# EAGLE design v1 (EAGLE 7.1.0)
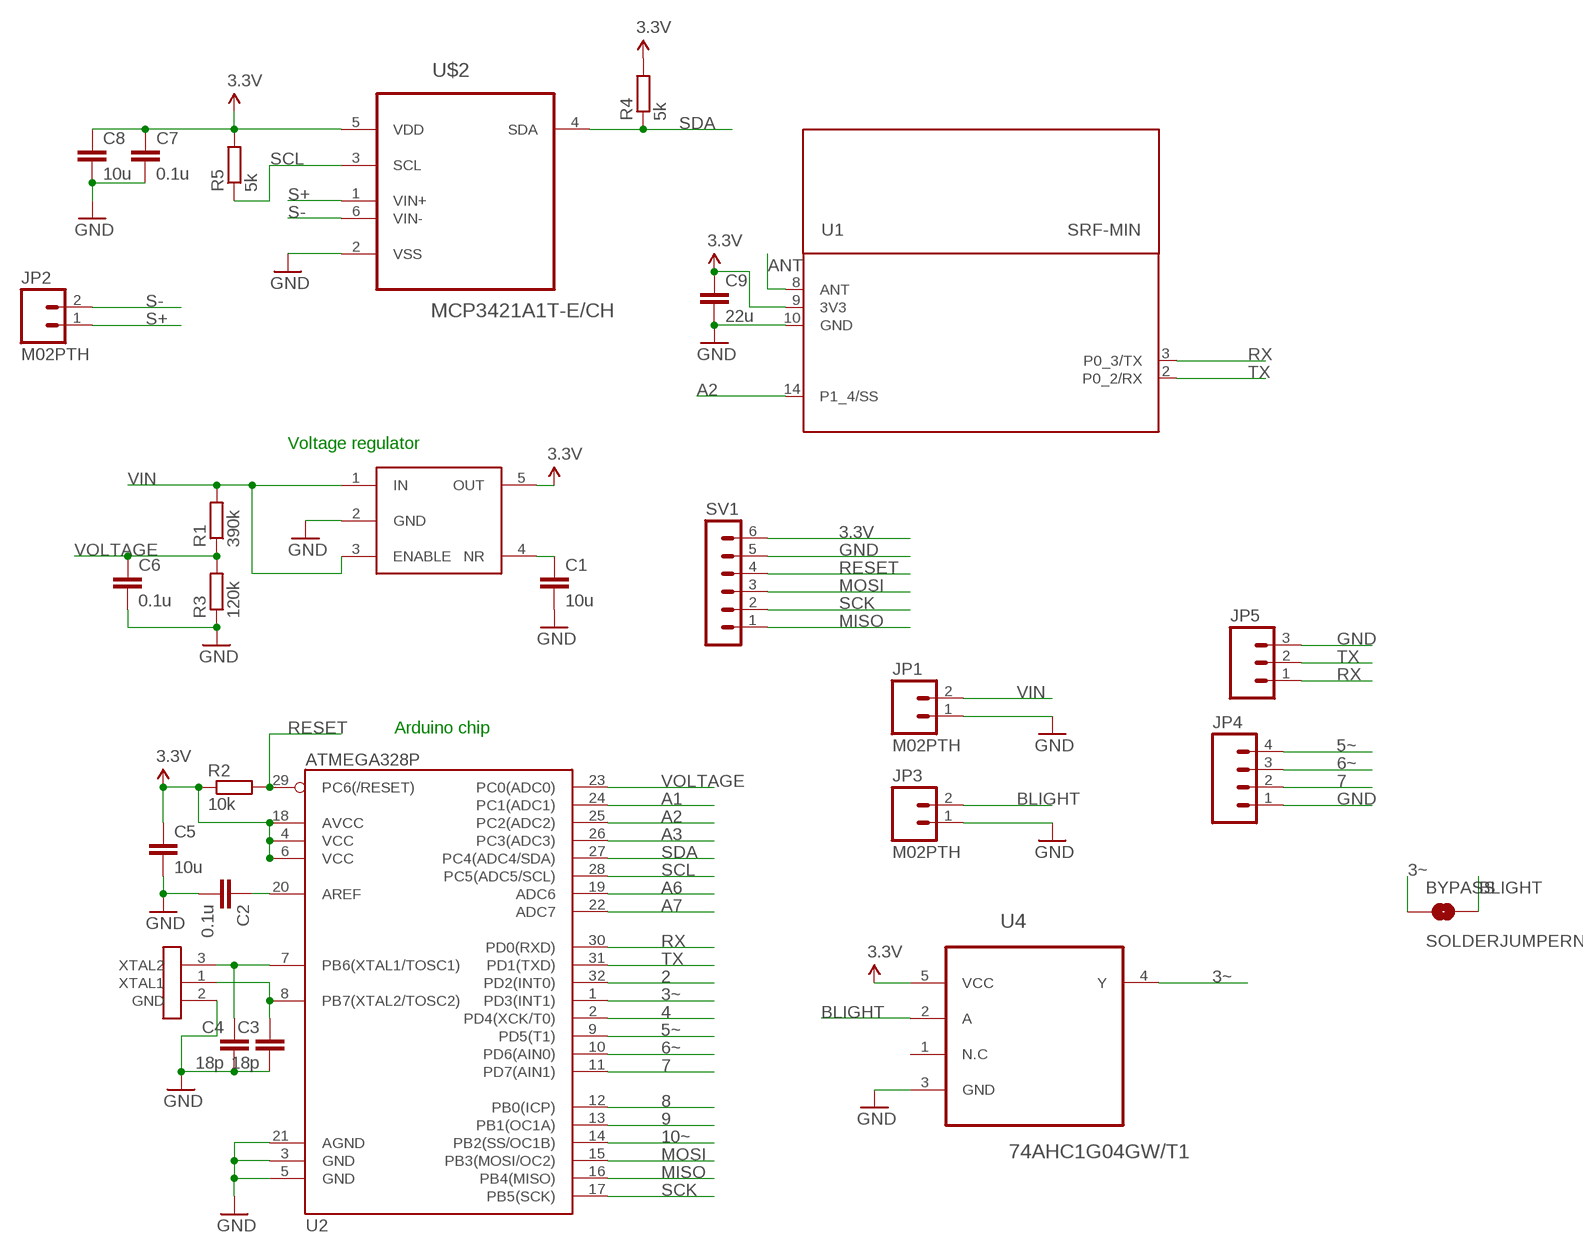
[diagram p0: schematic, sheet 1]

## Parts
BYPASS  SOLDERJUMPERNO  [SJ_2S-NO]
C1  10u  C-EUC0805  [C0805]
C2  0.1u  C-EUC0805  [C0805]
C3  18p  C-EUC0805  [C0805]
C4  18p  C-EUC0805  [C0805]
C5  10u  C-EUC0805  [C0805]
C6  0.1u  C-EUC0805  [C0805]
C7  0.1u  C-EUC0805  [C0805]
C8  10u  C-EUC0805  [C0805]
C9  22u  C-EUC0805  [C0805]
JP1  M02PTH  [1X02]
JP2  M02PTH  [1X02]
JP3  M02PTH  [1X02]
JP4  M04PTH  [1X04]
JP5  M03PTH  [1X03]
R1  390k  R-EU_R0805  [R0805]
R2  10k  R-EU_R0805  [R0805]
R3  120k  R-EU_R0805  [R0805]
R4  5k  R-EU_R0805  [R0805]
R5  5k  R-EU_R0805  [R0805]
SV1  MA06-1  [MA06-1]
TPS73133  TPS731XX  [SOT95P284X120-5N]
U1  SRF-MIN  [SRF-LANDING-1.2-MIN]
U2  ATMEGA328P  ATMEGA328_SMT  [TQFP32-08]
U4  74AHC1G04GW/T1  [SOT65P210X110-5N]
U$1  CRYSTAL-GND  [CRYSTAL-SMD-5X3-LARGE-GND]
U$2  MCP3421A1T-E/CH  [SOT95P270X145-6N]

## Nets
2: U2.32(PD2(INT0))
3.3V: C5.1 C7.1 C8.1 C9.1 R2.1 R4.2 R5.2 SV1.6 TPS73133.5(OUT) U1.9(3V3) U2.4(VCC) U2.6(VCC) U2.18(AVCC) U4.5(VCC) U$2.5(VDD)
3~: BYPASS.1 U2.1(PD3(INT1)) U4.4(Y)
4: U2.2(PD4(XCK/T0))
5~: JP4.4 U2.9(PD5(T1))
6~: JP4.3 U2.10(PD6(AIN0))
7: JP4.2 U2.11(PD7(AIN1))
8: U2.12(PB0(ICP))
9: U2.13(PB1(OC1A))
10~: U2.14(PB2(SS/OC1B))
A1: U2.24(PC1(ADC1))
A2: U1.14(P1_4/SS) U2.25(PC2(ADC2))
A3: U2.26(PC3(ADC3))
A6: U2.19(ADC6)
A7: U2.22(ADC7)
ANT: U1.8(ANT)
BLIGHT: BYPASS.2 JP3.2 U4.2(A)
GND: C1.2 C2.2 C3.2 C4.2 C5.2 C6.2 C7.2 C8.2 C9.2 JP1.1 JP3.1 JP4.1 JP5.3 R3.1 SV1.5 TPS73133.2(GND) U1.10(GND) U2.3(GND) U2.5(GND) U2.21(AGND) U4.3(GND) U$1.2(GND) U$2.2(VSS)
MISO: SV1.1 U2.16(PB4(MISO))
MOSI: SV1.3 U2.15(PB3(MOSI/OC2))
N$2: C2.1 U2.20(AREF)
N$3: C4.1 U2.7(PB6(XTAL1/TOSC1)) U$1.3(XTAL2)
N$4: C3.1 U2.8(PB7(XTAL2/TOSC2)) U$1.1(XTAL1)
N$7: C1.1 TPS73133.4(NR)
RESET: R2.2 SV1.4 U2.29(PC6(/RESET))
RX: JP5.1 U1.3(P0_3/TX) U2.30(PD0(RXD))
S+: JP2.1 U$2.1(VIN+)
S-: JP2.2 U$2.6(VIN-)
SCK: SV1.2 U2.17(PB5(SCK))
SCL: R5.1 U2.28(PC5(ADC5/SCL)) U$2.3(SCL)
SDA: R4.1 U2.27(PC4(ADC4/SDA)) U$2.4(SDA)
TX: JP5.2 U1.2(P0_2/RX) U2.31(PD1(TXD))
VIN: JP1.2 R1.2 TPS73133.1(IN) TPS73133.3(ENABLE)
VOLTAGE: C6.1 R1.1 R3.2 U2.23(PC0(ADC0))
Unconnected: U4.1(N.C)

## Notes on the sheet
- Voltage regulator
- Arduino chip

## Library data of the parts
BYPASS = SparkFun-Passives:SOLDERJUMPER: Solder Jumper Standard SMD solder jumper. Used to automate production. Two varients : Normally Open and Normally Closed are the same, but have different paste layers. NC will have a large amount of paste and should jumper during reflow.
C1-C9 = rcl:C-EU: CAPACITOR, European symbol
JP1-JP3 = SparkFun-Connectors:M02: Standard 2-pin 0.1" header. Use with - straight break away headers ( PRT-00116) - right angle break away headers (PRT-00553) - swiss pins (PRT-00743) - machine pins (PRT-00117) - female headers (PRT-00115) Molex polarized connector foot print use with: PRT-08233 with associated crimp pins and housings. 2.54_SCREWTERM for use with PRT-10571. 3.5mm Screw Terminal footprints for PRT-08084 5mm Screw Terminal footprints for use with PRT-08433
JP4 = SparkFun-Connectors:M04: Header 4 Standard 4-pin 0.1" header. Use with straight break away headers (SKU : PRT-00116), right angle break away headers (PRT-00553), swiss pins (PRT-00743), machine pins (PRT-00117), and female headers (PRT-00115). Molex polarized connector foot print use with SKU : PRT-08231 with associated crimp pins and housings. 1MM SMD Version SKU: PRT-10208
JP5 = SparkFun-Connectors:M03: Header 3 Standard 3-pin 0.1" header. Use with straight break away headers (SKU : PRT-00116), right angle break away headers (PRT-00553), swiss pins (PRT-00743), machine pins (PRT-00117), and female headers (PRT-00115). Molex polarized connector foot print use with SKU : PRT-08232 with associated crimp pins and housings.
R1-R5 = rcl:R-EU_: RESISTOR, European symbol
SV1 = con-lstb:MA06-1: PIN HEADER; OC_FARNELL: unknown; OC_NEWARK: unknown
TPS73133 = Ava:TPS731XX
U1 = Ciseco Footprints:SRF-MIN
U2 = SparkFun-DigitalIC:ATMEGA328_SMT: 32-Pin Atmega328 part Commonly used on Arduino compatible boards Available in QFP and QFN packages TQFP is IC-09069 QFN is non-stock; PROD_ID: IC-09069
U4 = 74AHC1G04GW:74AHC1G04GW/T1: Inverter; MPN: 74AHC1G04GW/T1; OC_FARNELL: 1085239; OC_NEWARK: 99K0513; PACKAGE: SOT353-1-5; SUPPLIER: NXP
U$1 = SparkFun-FreqCtrl:CRYSTAL-GND
U$2 = MCP3421:MCP3421A1T-E/CH: Analog-to-Digital Converter; MPN: MCP3421A1T-E/CH; OC_FARNELL: 1605568; OC_NEWARK: 11N7998; PACKAGE: SOT-6; SUPPLIER: Microchip

## Board
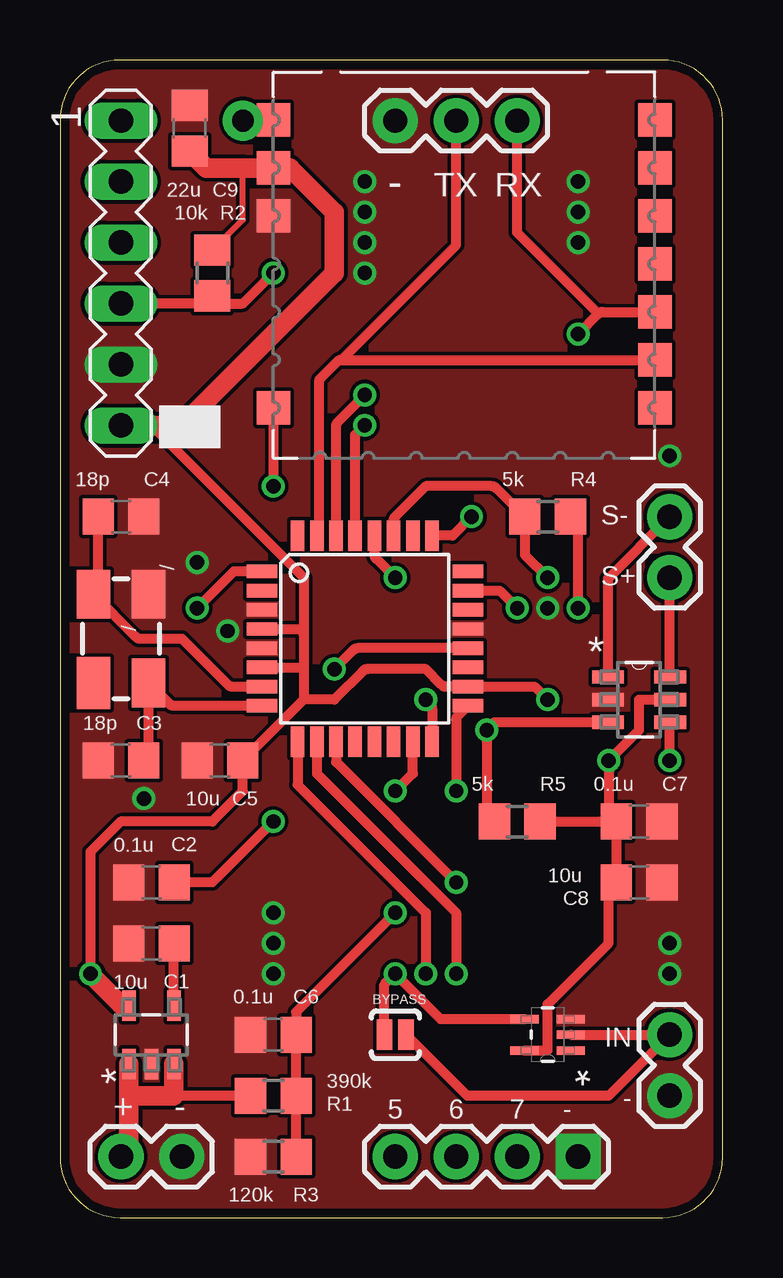
[diagram p1: board, top side]
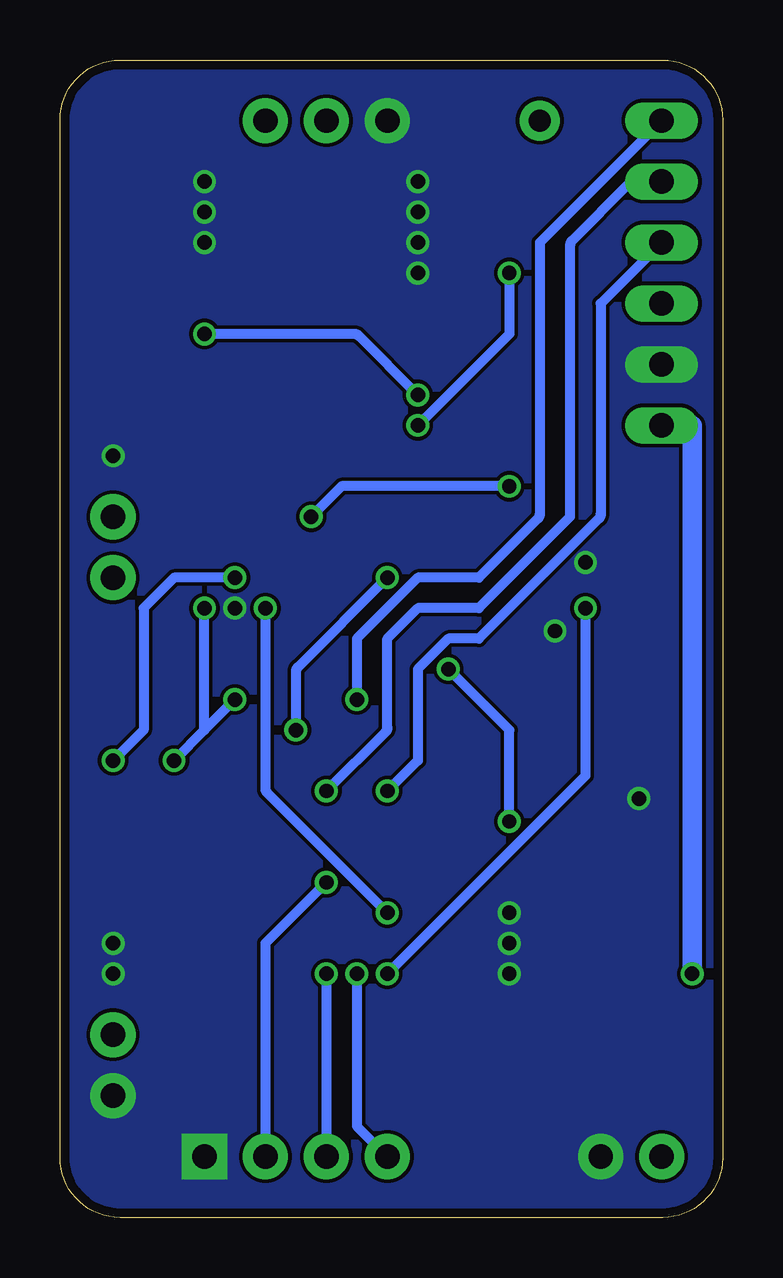
[diagram p2: board, bottom side, seen from below]

Size 27.61 x 48.25 mm. Coordinates in mm from the lower left corner, seen from the top.
Outline: 0,45.75 0,2.5 arc90 2.5,0 25.11,0 arc90 27.61,2.5 27.61,45.75 arc90 25.11,48.25 2.5,48.25 arc90 0,45.75
Copper layers (1*16): Top 0.0356mm / dielectric 1.5011mm / Bottom 0.0356mm
Design rules "LaenPCBOrder *": minimum track width 6mil, minimum drill 13mil, track to track 6mil, track to pad 6mil, pad to pad 6mil, via to via 6mil, smd to smd 6mil, copper to edge 15mil, drill to drill 6mil, minimum pad ring 7mil, minimum via ring 7mil, stop-mask expansion 3mil, vias tented up to drill 0mil, thermal gap 10mil

### Footprints (pad centres in the part's own frame; a part is rotated, then mirrored left to right if it is on the bottom)
SJ_2S-NO = smd 0.635 x 1.27: 1 -0.45,0; 2 0.45,0
C0805 = smd 1.3 x 1.5: 1 -0.95,0; 2 0.95,0
1X02 = drill 1.016 pad 1.88: 1 0,0; 2 2.54,0
1X04 = drill 1.016 pad 1.88 square: 1 0,0 | drill 1.016 pad 1.88: 2 2.54,0; 3 5.08,0; 4 7.62,0
1X03 = drill 1.016 pad 1.88: 1 0,0; 2 2.54,0; 3 5.08,0
R0805 = smd 1.3 x 1.5: 1 -0.95,0; 2 0.95,0
MA06-1 = drill 1.016 long: 1 -6.35,0; 2 -3.81,0; 3 -1.27,0; 4 1.27,0; 5 3.81,0; 6 6.35,0
SOT95P284X120-5N = smd 1.27 x 0.559: 1 -1.219,0.94; 2 -1.219,0; 3 -1.219,-0.94; 4 1.219,-0.94; 5 1.219,0.94
SRF-LANDING-1.2-MIN = smd 1.4 x 1.4: 1 15.9,2; 2 15.9,4; 3 15.9,6; 4 15.9,8; 5 15.9,10; 6 15.9,12; 7 15.9,14; 8 0,14; 9 0,12; 10 0,10; 14 0,2
TQFP32-08 = smd 1.27 x 0.559: 1 -4.293,2.8; 2 -4.293,2; 3 -4.293,1.2; 4 -4.293,0.4; 5 -4.293,-0.4; 6 -4.293,-1.2; 7 -4.293,-2; 8 -4.293,-2.8; 17 4.293,-2.8; 18 4.293,-2; 19 4.293,-1.2; 20 4.293,-0.4; 21 4.293,0.4; 22 4.293,1.2; 23 4.293,2; 24 4.293,2.8 | smd 0.559 x 1.27: 9 -2.8,-4.293; 10 -2,-4.293; 11 -1.2,-4.293; 12 -0.4,-4.293; 13 0.4,-4.293; 14 1.2,-4.293; 15 2,-4.293; 16 2.8,-4.293; 25 2.8,4.293; 26 2,4.293; 27 1.2,4.293; 28 0.4,4.293; 29 -0.4,4.293; 30 -1.2,4.293; 31 -2,4.293; 32 -2.8,4.293
SOT65P210X110-5N = smd 1.168 x 0.356: 1 -0.965,0.66; 2 -0.965,0; 3 -0.965,-0.66; 4 0.965,-0.66; 5 0.965,0.66
CRYSTAL-SMD-5X3-LARGE-GND = smd 2.032 x 1.397: 1 -1.85,-1.15; 2 1.85,-1.15; 3 1.85,1.15 | smd 2.159 x 1.397: 4 -1.85,1.15
SOT95P270X145-6N = smd 1.321 x 0.559: 1 -1.295,0.94; 2 -1.295,0; 3 -1.295,-0.94; 4 1.295,-0.94; 5 1.295,0; 6 1.295,0.94

### Placement (x,y rotation side)
BYPASS  13.97,7.62 0 top
C1  3.81,11.43 180 top
C2  3.81,13.97 180 top
C3  2.54,19.05 180 top
C4  2.54,29.21 0 top
C5  6.67,19.05 180 top
C6  8.89,7.62 180 top
C7  24.13,16.51 0 top
C8  24.13,13.97 0 top
C9  5.4,45.4 90 top
JP1  5.08,2.54 180 top
JP2  25.4,29.21 270 top
JP3  25.4,5.08 90 top
JP4  21.59,2.54 180 top
JP5  19.05,45.72 180 top
R1  8.89,5.08 180 top
R2  6.35,39.37 270 top
R3  8.89,2.54 0 top
R4  20.32,29.21 0 top
R5  19.05,16.51 0 top
SV1  2.54,39.37 270 top
TPS73133  3.81,7.62 90 top
U1  8.89,31.75 0 top
U2  12.7,24.13 0 top
U4  20.32,7.62 180 top
U$1  2.54,24.13 90 top
U$2  24.13,21.59 0 top

### Tracks (layer width: path | path; a pad name or v marks a point on that pad's centre or on a via)
3.3V  (via drill 0.6)
  Top 0.254: R2.1 7.62,41.59 7.62,43.75
  Top 0.406: TPS73133.5 2.7,8.84 arc-45 2.52,8.91 v1.27,10.16 1.27,15.24 2.54,16.51 6.35,16.51 7.62,17.78 C5.1 | 8.58,22.86 arc-45 U2.6 10.09,22.93 arc-90 10.16,22.86 | SV1.6 3.71,33.02 arc-45 3.88,32.95 10.16,26.67 10.16,24.28 | R5.2 C7.1 | 10.16,24.28 10.16,22.86 | 10.16,22.86 10.16,21.59 | U2.4 9.91,24.53 arc-90 10.16,24.28 | 10.16,21.59 11.43,21.59 12.63,22.79 arc-45 12.8,22.86 15.24,22.86 15.9,22.2 arc45 16.07,22.13 U2.18 19.78,22.13 v20.32,21.59 | C7.1 C8.1 22.86,13.65 22.86,11.43 20.32,8.89 20.32,6.96 U4.5 | C5.1 | C5.1 10.16,21.59 | v21.59,25.4 21.59,28.89 R4.2 | U$2.5 24.13,21.59 24.13,20.32 v22.86,19.05 22.86,16.83 C7.1
  Top 0.813: SV1.6 5.08,33.02 11.43,39.37 11.43,41.91 9.59,43.75 U1.9 7.62,43.75 6.1,43.75 C9.1 | v1.27,10.16 2.54,8.89
  Bottom 0.406: v20.32,21.59 21.59,20.32 | 21.59,20.32 v21.59,25.4 | 21.59,20.32 v22.86,19.05
  Bottom 0.813: SV1.6 1.27,33.02 v1.27,10.16
3~  (via drill 0.6)
  Top 0.406: U2.1 7.25,26.93 v5.71,25.4 | BYPASS.1 13.52,9.71 v13.97,10.16 15.85,8.28 U4.4
  Bottom 0.406: v13.97,10.16 5.71,18.41 v5.71,25.4
5~  (via drill 0.6)
  Top 0.406: U2.9 9.9,18.04 15.24,12.7 v15.24,10.16
  Bottom 0.406: v15.24,10.16 15.24,3.81 JP4.4
6~  (via drill 0.6)
  Top 0.406: U2.10 10.7,18.51 16.51,12.7 v16.51,10.16
  Bottom 0.406: v16.51,10.16 JP4.3
7  (via drill 0.6)
  Top 0.406: U2.11 11.5,18.98 v16.51,13.97
  Bottom 0.406: v16.51,13.97 19.05,11.43 JP4.2
A2  (via drill 0.6)
  Top 0.406: U1.14 v8.89,30.48 | v17.14,29.21 16.36,28.42 U2.25
  Bottom 0.406: v8.89,30.48 15.88,30.48 v17.14,29.21
ANT  (via drill 0.9 pad 1.68)
  Top 0.813: v7.62,45.72 8.86,45.72 U1.8
BLIGHT
  Top 0.406: U4.2 JP3.2 22.86,5.08 16.96,5.08 BYPASS.2
GND  (via drill 0.6)
  other vias: 12.7,39.37 12.7,40.64 12.7,41.91 12.7,43.18 5.71,27.3 3.49,17.46 6.99,24.45 20.32,25.4 25.4,10.16 25.4,11.43 25.4,31.75 21.59,43.18 21.59,41.91 21.59,40.64 8.89,12.7 8.89,11.43 8.89,10.16
  pour Top (no thermals): -1.27,50.8 30.23,50.8 arc-90 30.48,50.55 30.48,-2.54 -2.29,-2.54 arc-90 -2.54,-2.29 -2.54,50.8
  pour Bottom (no thermals): -1.27,50.8 30.23,50.8 arc-90 30.48,50.55 30.48,-2.54 -2.29,-2.54 arc-90 -2.54,-2.29 -2.54,50.8
MISO  (via drill 0.6)
  Top 0.406: v15.24,21.59 15.43,21.4 arc-45 15.5,21.23 U2.16
  Bottom 0.406: SV1.1 7.62,40.64 7.62,29.32 arc45 7.69,29.14 10.16,26.67 12.7,26.67 15.24,24.13 v15.24,21.59
MOSI  (via drill 0.6)
  Top 0.406: v13.97,17.78 14.7,18.51 U2.15
  Bottom 0.406: SV1.3 5.08,38.1 5.08,29.32 arc45 5.15,29.14 10.16,24.13 11.43,24.13 12.7,22.86 12.7,19.05 v13.97,17.78
N$2  (via drill 0.6)
  Top 0.406: U2.20 12.4,23.73 arc45 12.23,23.66 v11.43,22.86 | v8.89,16.51 6.35,13.97 C2.1
  Bottom 0.406: v11.43,22.86 8.89,20.32 v8.89,16.51
N$3
  Top 0.406: U2.7 7.18,22.13 arc-45 7.01,22.2 5.08,24.13 3.35,24.13 arc-45 3.17,24.2 U$1.3 1.52,26.11 arc45 1.59,26.29 C4.1
N$4
  Top 0.406: C3.1 3.62,19.18 arc45 3.69,19.36 U$1.1 4.57,21.4 arc45 4.75,21.33 U2.8
N$7
  Top 0.406: TPS73133.4 4.75,11.4 arc-45 C1.1
RESET  (via drill 0.6)
  Top 0.406: SV1.4 5.92,38.1 arc45 6.1,38.17 R2.2 6.35,38.1 7.62,38.1 v8.89,39.37 | U2.29 12.3,32.62 v12.7,33.02
  Bottom 0.406: v8.89,39.37 8.89,36.83 v12.7,33.02
RX  (via drill 0.6)
  Top 0.406: v21.59,36.83 22.44,37.68 | 22.44,37.68 arc-45 22.61,37.75 U1.3 | U2.30 11.5,32.98 arc-45 11.57,33.16 v12.7,34.29 | 22.44,37.68 19.05,41.06 JP5.1
  Bottom 0.406: v12.7,34.29 15.17,36.76 arc-45 15.35,36.83 v21.59,36.83
S+
  Top 0.406: U$2.1 22.84,26.64 JP2.1
S-
  Top 0.406: U$2.6 25.4,22.53 JP2.2
SCK  (via drill 0.6)
  Top 0.406: U2.17 16.58,20.92 arc45 16.51,20.74 v16.51,17.78
  Bottom 0.406: SV1.2 3.71,43.18 arc-45 3.88,43.11 6.28,40.71 arc-45 6.35,40.53 6.35,29.21 10.16,25.4 12.7,25.4 13.97,24.13 13.97,20.43 arc45 14.04,20.25 v16.51,17.78
SCL  (via drill 0.6)
  Top 0.406: U2.28 13.1,27.64 arc45 13.17,27.47 v13.97,26.67 | U$2.3 18.11,20.65 v17.78,20.32 17.78,16.83 R5.1
  Bottom 0.406: v13.97,26.67 17.71,22.93 arc-45 17.78,22.75 v17.78,20.32
SDA  (via drill 0.6)
  Top 0.406: U2.27 13.9,29.04 arc-45 13.97,29.21 15.24,30.48 18,30.48 arc-45 18.17,30.41 R4.1 19.37,27.62 v20.32,26.67 | v25.4,19.05 25.4,20.62 U$2.4
  Bottom 0.406: v20.32,26.67 22.86,26.67 24.13,25.4 24.13,20.32 v25.4,19.05
TX
  Top 0.406: U2.31 10.72,28.44 arc45 10.79,28.62 10.79,34.82 arc-45 10.87,35 11.55,35.68 arc-45 11.72,35.75 | 11.72,35.75 U1.2 | 11.72,35.75 16.51,40.53 JP5.2
VIN
  Top 0.406: R1.2 4.75,5.08
  Top 0.813: JP1.2 2.87,2.87 TPS73133.1 2.87,5.08 4.75,5.08 TPS73133.3 4.75,5.69
VOLTAGE  (via drill 0.6)
  Top 0.406: R3.2 R1.1 C6.1 9.84,8.57 v13.97,12.7 | U2.23 18.32,26.13 v19.05,25.4
  Bottom 0.406: v19.05,25.4 19.05,17.89 arc-45 18.98,17.71 v13.97,12.7

### Text on the board
_tsilk: - | TX | RX | S- | / | S+ | / | IN | - | + | - | 5 | 6 | 7 | -